# EAGLE design LightModuleTEMT6000 (EAGLE 5.10)
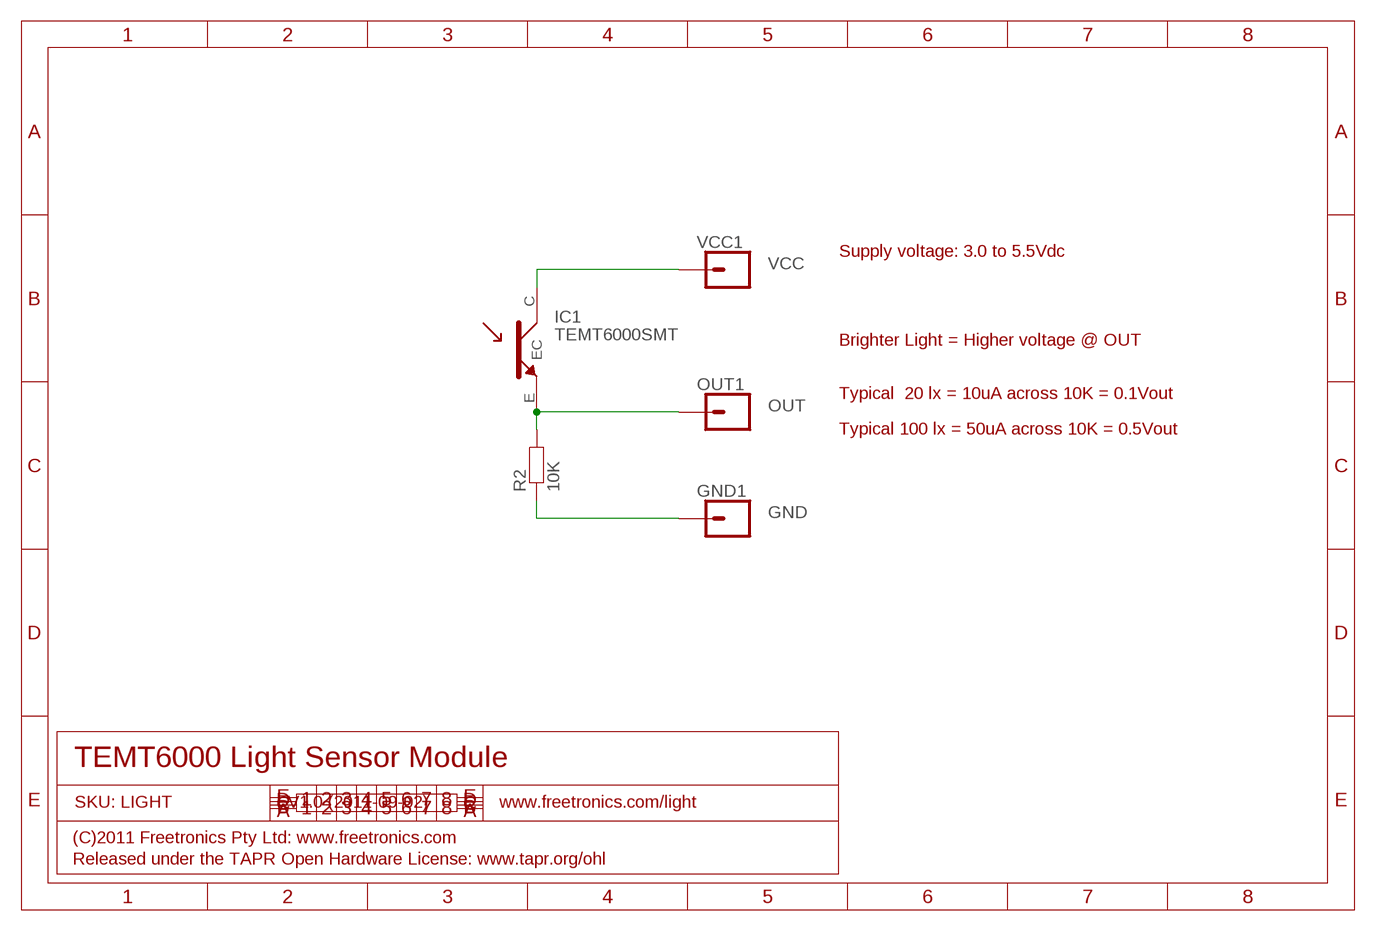
[diagram p0: schematic, sheet 1]

## Parts
GND1  M01PTH  [1X01]
IC1  TEMT6000SMT  [TEMT6000]
OUT1  M01PTH  [1X01]
R2  10K  RESISTOR0603  [0603]
VCC1  M01PTH  [1X01]

## Nets
GND: GND1.1 R2.1
OUT: IC1.E OUT1.1 R2.2
VCC: IC1.C VCC1.1

## Notes on the sheet
- Supply voltage: 3.0 to 5.5Vdc
- Brighter Light = Higher voltage @ OUT
- Typical  20 lx = 10uA across 10K = 0.1Vout
- Typical 100 lx = 50uA across 10K = 0.5Vout
- TEMT6000 Light Sensor Module
- SKU: LIGHT | V1.0 (2011-09-02) | www.freetronics.com/light
- (C)2011 Freetronics Pty Ltd: www.freetronics.com
- Released under the TAPR Open Hardware License: www.tapr.org/ohl

## Library data of the parts
GND1 OUT1 VCC1 = freetronics-master-v1:M01: Header 1 Standard 1-pin 0.1" header. Use with straight break away headers (SKU : PRT-00116), right angle break away headers (PRT-00553), swiss pins (PRT-00743), machine pins (PRT-00117), and female headers (PRT-00115).
IC1 = freetronics-jon:TEMT6000
R2 = freetronics-master-v1:RESISTOR: Resistor Basic schematic elements and footprints for 0603, 1206, and PTH 1/10th watt (small) resistors.

## Board
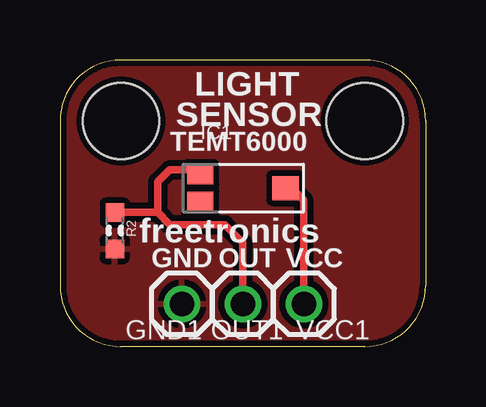
[diagram p1: board, top side]
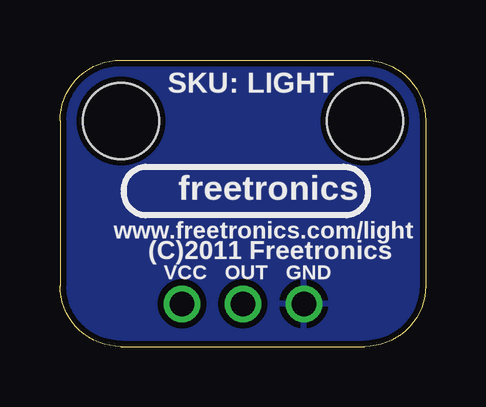
[diagram p2: board, bottom side, seen from below]

Size 15.24 x 11.94 mm. Coordinates in mm from the lower left corner, seen from the top.
Outline: 2.54,11.94 arc90 0,9.4 0,2.54 arc90 2.54,0 12.7,0 arc90 15.24,2.54 15.24,9.4 arc90 12.7,11.94 2.54,11.94
Copper layers (1*16): Top 0.035mm / dielectric 1.5mm / Bottom 0.035mm
Design rules "default *": minimum track width 8mil, minimum drill 15mil, track to track 10mil, track to pad 10mil, pad to pad 10mil, via to via 10mil, smd to smd 8mil, copper to edge 10mil, drill to drill 8mil, minimum pad ring 10mil, minimum via ring 8mil, stop-mask expansion 4mil, vias tented up to drill 25mil, thermal gap 10mil
Holes 3.17 mm at 2.54,9.4 12.7,9.4

### Footprints (pad centres in the part's own frame; a part is rotated, then mirrored left to right if it is on the bottom)
1X01 = drill 1.016 round: 1 0,0
TEMT6000 = smd 1.1 x 1: C 2.28,0 | smd 1.1 x 0.8: E -1.27,0.55; NC -1.27,-0.55
0603 = smd 0.762 x 0.762: 1 -0.762,0; 2 0.762,0

### Placement (x,y rotation side)
GND1  5.08,1.78 270 top
IC1  7.11,6.6 0 top
OUT1  7.62,1.78 270 top
R2  2.29,4.83 90 top
VCC1  10.16,1.78 270 top

### Tracks (layer width: path | path; a pad name or v marks a point on that pad's centre or on a via)
GND
  pour Bottom: 15.24,9.4 arc90 12.7,11.94 2.54,11.94 arc90 0,9.4 0,2.54 arc90 2.54,0 12.7,0 arc90 15.24,2.54
  pour Top: 12.7,11.94 2.54,11.94 arc90 0,9.4 0,2.54 arc90 2.54,0 12.7,0 arc90 15.24,2.54 15.24,9.4 arc90
OUT
  Top 0.305: OUT1.1 7.62,4.32 6.86,5.08 4.57,5.08 4.06,5.59 | R2.2 4.06,5.59 | IC1.E 5.8,7.37 4.57,7.37 4.06,6.86 4.06,5.59
VCC
  Top 0.305: VCC1.1 10.16,6.1 9.4,6.86 IC1.C

### Text on the board
tPlace: LIGHT | SENSOR | TEMT6000 | freetronics | GND | OUT | VCC
bPlace: SKU: LIGHT | freetronics | www.freetronics.com/light | (C)2011 Freetronics | GND | OUT | VCC